# Altium schematic sheet Filter Bank.SchDoc
size A4; SheetNumber: 3; SheetTotal: 3
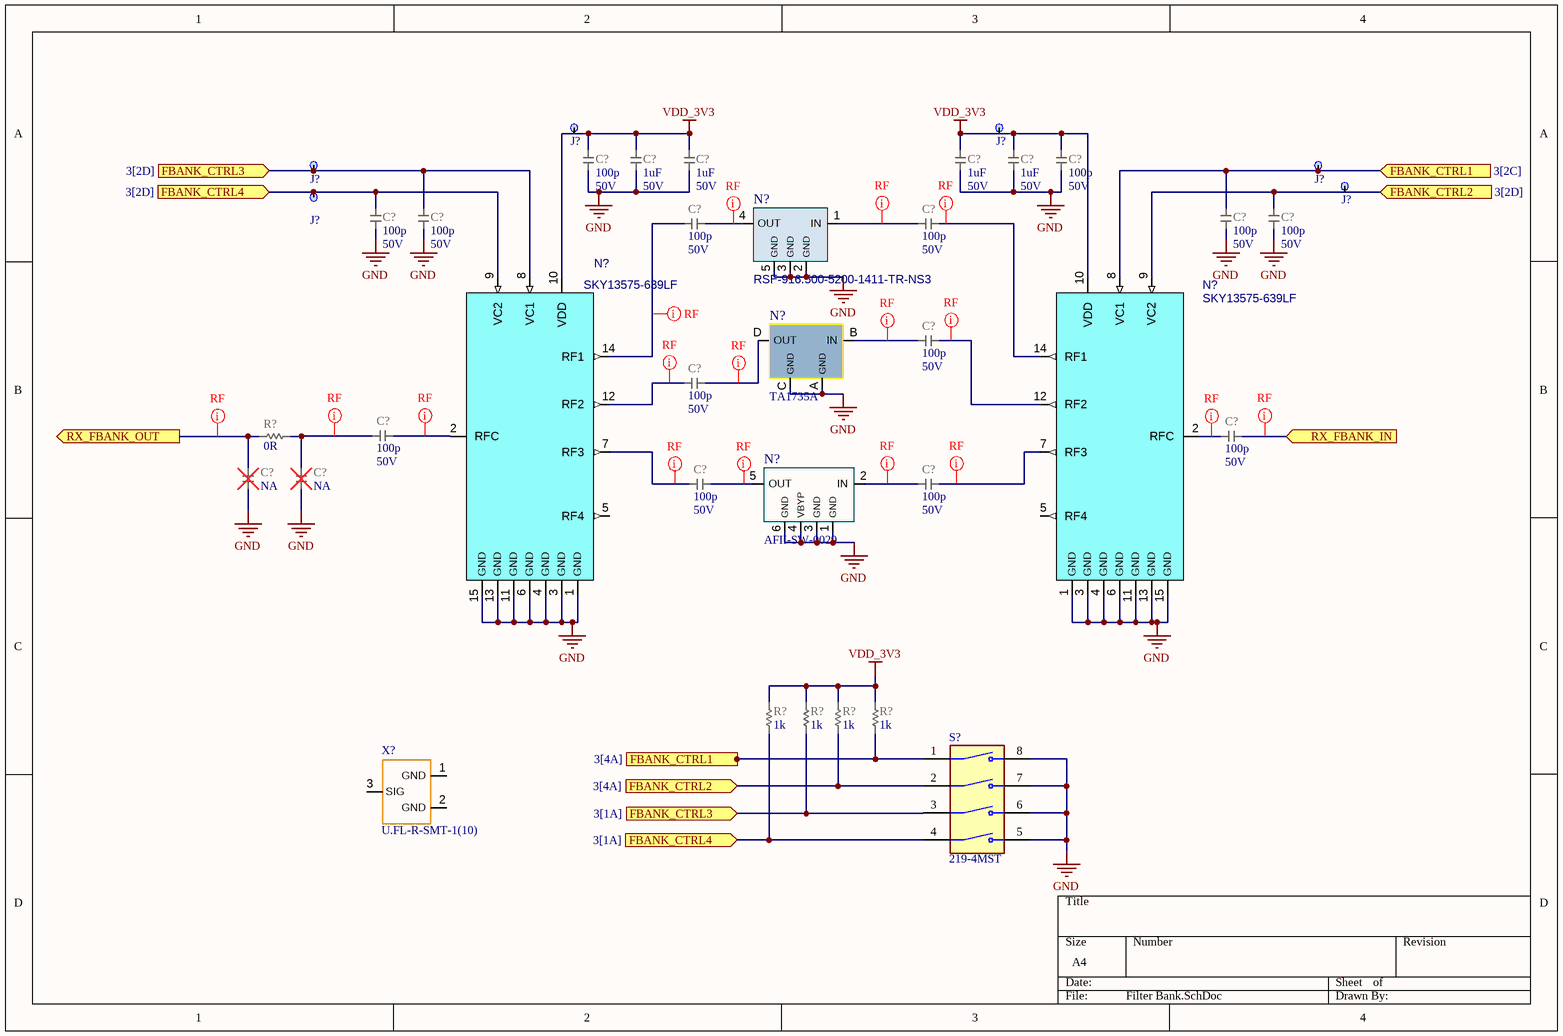
[diagram p0: Filter Bank.SchDoc]

## Parts
(Parts that share a designator on the sheet are numbered #1, #2 ... from top to bottom, then left to right.)
C?#1  value 100p  Voltage: 50V  [CAP_0603_UN1Q]  (hidden comment: CAP_0603_100p)
C?#2  value 1uF  Voltage: 50V  [CAP_0603_UN1Q]  (hidden comment: CAP_0603_1u_X7R)
C?#3  value 1uF  Voltage: 50V  [CAP_0603_UN1Q]  (hidden comment: CAP_0603_1u_X7R)
C?#4  value 1uF  Voltage: 50V  [CAP_0603_UN1Q]  (hidden comment: CAP_0603_1u_X7R)
C?#5  value 1uF  Voltage: 50V  [CAP_0603_UN1Q]  (hidden comment: CAP_0603_1u_X7R)
C?#6  value 100p  Voltage: 50V  [CAP_0603_UN1Q]  (hidden comment: CAP_0603_100p)
C?#7  value 100p  Voltage: 50V  [CAP_0603_UN1Q]  (hidden comment: CAP_0603_100p)
C?#8  value 100p  Voltage: 50V  [CAP_0603_UN1Q]  (hidden comment: CAP_0603_100p)
C?#9  value 100p  Voltage: 50V  [CAP_0603_UN1Q]  (hidden comment: CAP_0603_100p)
C?#10  value 100p  Voltage: 50V  [CAP_0603_UN1Q]  (hidden comment: CAP_0603_100p)
C?#11  value 100p  Voltage: 50V  [CAP_0603_UN1Q]  (hidden comment: CAP_0603_100p)
C?#12  value 100p  Voltage: 50V  [CAP_0603_UN1Q]  (hidden comment: CAP_0603_100p)
C?#13  value 100p  Voltage: 50V  [CAP_0603_UN1Q]  (hidden comment: CAP_0603_100p)
C?#14  value 100p  Voltage: 50V  [CAP_0603_UN1Q]  (hidden comment: CAP_0603_100p)
C?#15  value 100p  Voltage: 50V  [CAP_0603_UN1Q]  (hidden comment: CAP_0603_100p)
C?#16  value 100p  Voltage: 50V  [CAP_0603_UN1Q]  (hidden comment: CAP_0603_100p)
C?#17  value NA  [CAP_0603_UN1Q]  (hidden comment: CAP_0603_NA)
C?#18  value NA  [CAP_0603_UN1Q]  (hidden comment: CAP_0603_NA)
C?#19  value 100p  Voltage: 50V  [CAP_0603_UN1Q]  (hidden comment: CAP_0603_100p)
C?#20  value 100p  Voltage: 50V  [CAP_0603_UN1Q]  (hidden comment: CAP_0603_100p)
J?#1  Testpoint, Surface, 1.0mm  [TP_1mm_UN1Q]  (value not drawn)  (no BOM)
J?#2  Testpoint, Surface, 1.0mm  [TP_1mm_UN1Q]  (value not drawn)  (no BOM)
J?#3  Testpoint, Surface, 1.0mm  [TP_1mm_UN1Q]  (value not drawn)  (no BOM)
J?#4  Testpoint, Surface, 1.0mm  [TP_1mm_UN1Q]  (value not drawn)  (no BOM)
J?#5  Testpoint, Surface, 1.0mm  [TP_1mm_UN1Q]  (value not drawn)  (no BOM)
J?#6  Testpoint, Surface, 1.0mm  [TP_1mm_UN1Q]  (value not drawn)  (no BOM)
N?#1  RSF-916.500-5200-1411-TR-NS3  [RSF-916.500-5200-1411-TR-NS3]
N?#2  TA1735A  [TA1735A_SM2016-4]
N?#3  SKY13575-639LF  [SKY13575-639LF-Footprint]
N?#4  SKY13575-639LF  [SKY13575-639LF-Footprint]
N?#5  AFII-SW-0029  [SM3030_6PIN_H1_25]
R?#1  value 0R  [RES_0603_UN1Q]  (hidden comment: RES_0603_0R)
R?#2  value 1k  [RES_0603_UN1Q]  (hidden comment: RES_0603_1k)
R?#3  value 1k  [RES_0603_UN1Q]  (hidden comment: RES_0603_1k)
R?#4  value 1k  [RES_0603_UN1Q]  (hidden comment: RES_0603_1k)
R?#5  value 1k  [RES_0603_UN1Q]  (hidden comment: RES_0603_1k)
S?  219-4MST  [SW_219-4MST]
X?  Part Number: U.FL-R-SMT-1(10)  [U_FL_HRS_V3]  (hidden comment: U_FL_V3)

## Ports
FBANK_CTRL1 (in, see 3[2C]), FBANK_CTRL1 (in, see 3[4A]), FBANK_CTRL2 (in, see 3[2D]), FBANK_CTRL2 (in, see 3[4A]), FBANK_CTRL3 (in, see 3[1A]), FBANK_CTRL3 (in, see 3[2D]), FBANK_CTRL4 (in, see 3[1A]), FBANK_CTRL4 (in, see 3[2D]), RX_FBANK_IN (in), RX_FBANK_OUT (out)

## Nets
GND: C?#1.2 C?#2.1 C?#3.1 C?#4.1 C?#5.1 C?#6.2 C?#7.2 C?#8.2 C?#11.2 C?#12.2 C?#17.1 C?#18.1 N?#1.2(GND) N?#1.3(GND) N?#1.5(GND) N?#2.A(GND) N?#2.C(GND) N?#3.1(GND) N?#3.3(GND) N?#3.4(GND) N?#3.6(GND) N?#3.11(GND) N?#3.13(GND) N?#3.15(GND) N?#4.1(GND) N?#4.3(GND) N?#4.4(GND) N?#4.6(GND) N?#4.11(GND) N?#4.13(GND) N?#4.15(GND) N?#5.1(GND) N?#5.3(GND) N?#5.4(VBYP) N?#5.6(GND) S?.5 S?.6 S?.7 S?.8
VDD_3V3: C?#1.1 C?#2.2 C?#3.2 C?#4.2 C?#5.2 C?#6.1 J?#1.1(TP) J?#2.1(TP) N?#3.10(VDD) N?#4.10(VDD) R?#2.2 R?#3.2 R?#4.2 R?#5.2
FBANK_CTRL1: C?#11.1 J?#4.1(TP) N?#4.8(VC1) R?#5.1 S?.1 ; port FBANK_CTRL1
FBANK_CTRL2: C?#12.1 J?#5.1(TP) N?#4.9(VC2) R?#4.1 S?.2 ; port FBANK_CTRL2
FBANK_CTRL3: C?#8.1 J?#3.1(TP) N?#3.8(VC1) R?#3.1 S?.3 ; port FBANK_CTRL3
FBANK_CTRL4: C?#7.1 J?#6.1(TP) N?#3.9(VC2) R?#2.1 S?.4 ; port FBANK_CTRL4
RX_FBANK_IN: C?#16.1 ; port RX_FBANK_IN
RX_FBANK_OUT: C?#17.2 R?#1.1 ; port RX_FBANK_OUT
NetC?#9_1: C?#9.1 N?#1.4(OUT)
NetC?#9_2: C?#9.2 N?#3.14(RF1)
NetC?#10_1: C?#10.1 N?#4.14(RF1)
NetC?#10_2: C?#10.2 N?#1.1(IN)
NetC?#13_1: C?#13.1 N?#4.12(RF2)
NetC?#13_2: C?#13.2 N?#2.B(IN)
NetC?#14_1: C?#14.1 N?#2.D(OUT)
NetC?#14_2: C?#14.2 N?#3.12(RF2)
NetC?#15_1: C?#15.1 N?#3.2(RFC)
NetC?#15_2: C?#15.2 C?#18.2 R?#1.2
NetC?#16_2: C?#16.2 N?#4.2(RFC)
NetC?#19_1: C?#19.1 N?#5.5(OUT)
NetC?#19_2: C?#19.2 N?#3.7(RF3)
NetC?#20_1: C?#20.1 N?#4.7(RF3)
NetC?#20_2: C?#20.2 N?#5.2(IN)

Not connected (* = marked no-connect by the designer): N?#3 5(RF4); N?#4 5(RF4); X? 1(GND) 2(GND) 3(SIG)

## Layout directives
net class RF: (no net found under the mark), NetC?#9_1, NetC?#10_1, NetC?#10_2, NetC?#13_1, NetC?#13_2, NetC?#14_1, NetC?#14_2, NetC?#15_1, NetC?#15_2, NetC?#16_2, NetC?#19_1, NetC?#19_2, NetC?#20_1, NetC?#20_2, RX_FBANK_IN, RX_FBANK_OUT

## Library data of the parts
C?#1 C?#6-C?#16 C?#19 C?#20 = CMP-001-000378-11: CAP; Manufacturer: Murata; Part Number: GCM188R71H102KA37J; Temperature characteristics: X7R; HasBeenBuilt: TBD; System: RLC; Alternative component: Allowed; Sort order: 306; Tolerance: +/-10%; Creation date: 20210927; Package: 0603; ComponentLink4Description: 4_X-information; ComponentLink2Description: 2_Product page; ECCN: EAR99; RoHS: RoHS3; Operating temperature range: -55 ... +125°C; ComponentLink3Description: 3_X-information; Source: RLC_UN1Q.SchLib; ComponentLink1Description: 1_Datasheet; Manufacturer Part Number: GCM188R71H102KA37J; Component Type: Capacitor
C?#2-C?#5 = CMP-001-000333-14: CAP; Part Number: UMK107AB7105KA-T; Manufacturer: Taiyo Yuden; Tolerance: +/-20%; Sort order: 306; HasBeenBuilt: TBD; Alternative component: Allowed; Temperature characteristics: X7R; System: RLC; Package: 0603; ComponentLink1Description: 1_Datasheet; ComponentLink2Description: 2_Product page; ComponentLink3Description: 3_X-information; ComponentLink4Description: 4_X-information; Creation date: 20210917; Source: RLC_UN1Q.SchLib; Manufacturer Part Number: UMK107AB7105KA-T; Component Type: Capacitor
C?#17 C?#18 = CMP-001-000259-10: Not Assembled - CAP; Sort order: 999; System: RLC; HasBeenBuilt: TBD; Creation date: 20190101; Package: 0603; Source: RLC_UN1Q.SchLib; ComponentLink3Description: 3_X-information; ComponentLink1Description: 1_Datasheet; ComponentLink2Description: 2_Product page; ComponentLink4Description: 4_X-information; Component Type: Capacitor
J?#1-J?#6 = CMP-001-000153-12: Testpoint 1.0mm; Part Number: TP 1mm; Sort order: -; HasBeenBuilt: -; ClassName: SMALL; ComponentLink1Description: 1_Datasheet; ComponentLink2Description: 2_Product page; ComponentLink3Description: 3_X-information; ComponentLink4Description: 4_X-information; Creation date: 20200101; System: Test Point; Design Item ID: TP_1mm; Source: Conn_UN1Q.SchLib; Component Type: Test Point
N?#1 = CMP-001-001272-4: 916.5 MHz SAW FILTER, IL 2.8; Manufacturer: RALTRON; Manufacturer: Raltron Electronics; System: RF; Sort order: 701; Part Number: RSF-916.500-5200-1411-TR-NS3; ComponentLink2URL: https://www.raltron.com/saw-filters-by-frequency/?3186_device=laptop&3186_paged=4; Dimensions WxLxH: 1.4 x 1.1 x  0.6mm; ComponentLink2Description: 2_Product page; ComponentLink1Description: 1_Datasheet; ComponentLink4Description: 4_X-information; ComponentLink3Description: 3_X-information; Package: 5-SMD; ComponentLink1URL: https://www.raltron.com/webproducts/specs/SAW_FILTER/RSF-916.500-5200-1411-TR-NS3.pdf; Operating temperature range: -40 ... +95C; Creation date: 20240711; Manufacturer Part Number: RSF-916.500-5200-1411-TR-NS3; Component Type: RF Discrete
N?#2 = CMP-001-001528-1: 867.5 MHz SAW Filter, IL 3.5 dB, 15 MHz BW; Manufacturer: TAI-SAW; Manufacturer: TST - Tamsan; Sort order: 701; System: RF; Part Number: TA1735A; Operating temperature range: -30 to +80 °C; Package: SM2016-4; Dimensions WxLxH: 1.6 x 2 x 0.90 mm; ComponentLink1Description: 1_Datasheet; ComponentLink1URL: https://www.taisaw.com/assets/PDF/TA1735A%20_Rev.1.0_.pdf; Creation date: 20250828; ECCN: EAR99; ComponentLink2Description: 2_Product page; ComponentLink3Description: 3_X-information; ComponentLink4Description: 4_X-information; RoHS: RoHS 3; Manufacturer Part Number: TA1735A; Component Type: RF Discrete
N?#3 N?#4 = CMP-001-001260-10: Dual-Band Matched SP4T Wi-Fi Switch; Manufacturer: Skyworks; Manufacturer: Skyworks Solutions; Sort order: 711; System: RF; Part Number: SKY13575-639LF; ComponentLink1URL: https://www.skyworksinc.com/-/media/SkyWorks/Documents/Products/2201-2300/SKY13575_639LF_203270D.pdf; ClassName: BIG; ComponentLink4Description: 4_X-information; ComponentLink2URL: https://www.skyworksinc.com/en/Products/switches/SKY13575-639LF; Dimensions WxLxH: 1.6 x 1.6 x 0.5; Operating temperature range: -40C ... +90C; ECCN: 5A991.g; Creation Date: 20240626; ComponentLink2Description: 2_Product page; Package: QFN14; ComponentLink3Description: 3_X-information; ComponentLink1Description: 1_Datasheet; Manufacturer Part Number: SKY13575-639LF; Component Type: RF IC
N?#5 = CMP-001-001529-1: 902 - 928 MHz SAW Filter; Manufacturer: RFMi; Manufacturer: Abracon; Manufacturer Part Number: AFII-SW-0029-T; Sort order: 701; HasBeenBuilt: False; System: RF; Operating temperature range: -45 ... +85C; Package: 3030; Dimensions WxLxH: 3 x 3 x 1.25mm; ComponentLink1Description: 1_Datasheet; ComponentLink1URL: https://abracon.com/datasheets/AFII-SW-0029.pdf; Creation date: 20250828; Design Item ID: AFII-SW-0029; ECCN: EAR99; ComponentLink3Description: 3_X-information; ComponentLink2Description: 2_Product page; ComponentLink4Description: 4_X-information; RoHS: RoHS 3; Component Type: RF Discrete; Part Number: AFII-SW-0029
R?#1 = CMP-001-000441-13: RES; Manufacturer: YAGEO; Part Number: RC0603FR-070RL; Alternative component: Allowed; HasBeenBuilt: TBD; Tolerance: 5%; Sort order: 326; Power Rating: 1/10W; System: RLC; ComponentLink2Description: 2_Product page; Source: RLC_UN1Q.SchLib; ComponentLink3Description: 3_X-information; ComponentLink1Description: 1_Datasheet; Package: 0603; Creation date: 20190101; ComponentLink4Description: 4_X-information; Component Type: Resistor
R?#2-R?#5 = CMP-001-000441-13: RES; Manufacturer: YAGEO; Alternative component: Allowed; HasBeenBuilt: TBD; Tolerance: 5%; Sort order: 326; Power Rating: 1/10W; System: RLC; ComponentLink2Description: 2_Product page; Source: RLC_UN1Q.SchLib; ComponentLink3Description: 3_X-information; ComponentLink1Description: 1_Datasheet; Package: 0603; Creation date: 20190101; ComponentLink4Description: 4_X-information; Component Type: Resistor
S? = 219-4MST: Dip Switch SPST 4 Position Surface Mount Slide (Standard) Actuator 100mA 20VDC; MF: CTS Electronic Components; SnapEDA_Link: https://www.snapeda.com/parts/219-4MST/CTS+Components/view-part/?ref=snap; Package: None; Value: *; MP: 219-4MST; Check_prices: https://www.snapeda.com/parts/219-4MST/CTS+Components/view-part/?ref=eda
X? = CMP-001-000002-11: U.FL Connector, v3, updated pads smaller by Sercom.; Manufacturer: Hirose; Manufacturer: HIROSE ELECTRIC; Sort order: 111; HasBeenBuilt: True; ClassName: BIG; ComponentLink1Description: 1_Datasheet; ComponentLink1URL: https://www.hirose.com/product/document?clcode=CL0331-0472-2-80&productname=U.FL-R-SMT-1(80)&series=U.FL&documenttype=2DDrawing&lang=en&documentid=0001257922; ComponentLink2Description: 2_Product page; ComponentLink3Description: 3_X-information; ComponentLink4Description: 4_X-information; Creation date: 20200101; System: Connector; ECCN: EAR99; Design Item ID: U_FL_V3; Source: Conn_UN1Q.SchLib; RoHS: RoHS 3; Manufacturer Part Number: U.FL-R-SMT-1(10); Component Type: RF Connector